# EAGLE design CommCenter_0.1 (EAGLE 7.3.0)
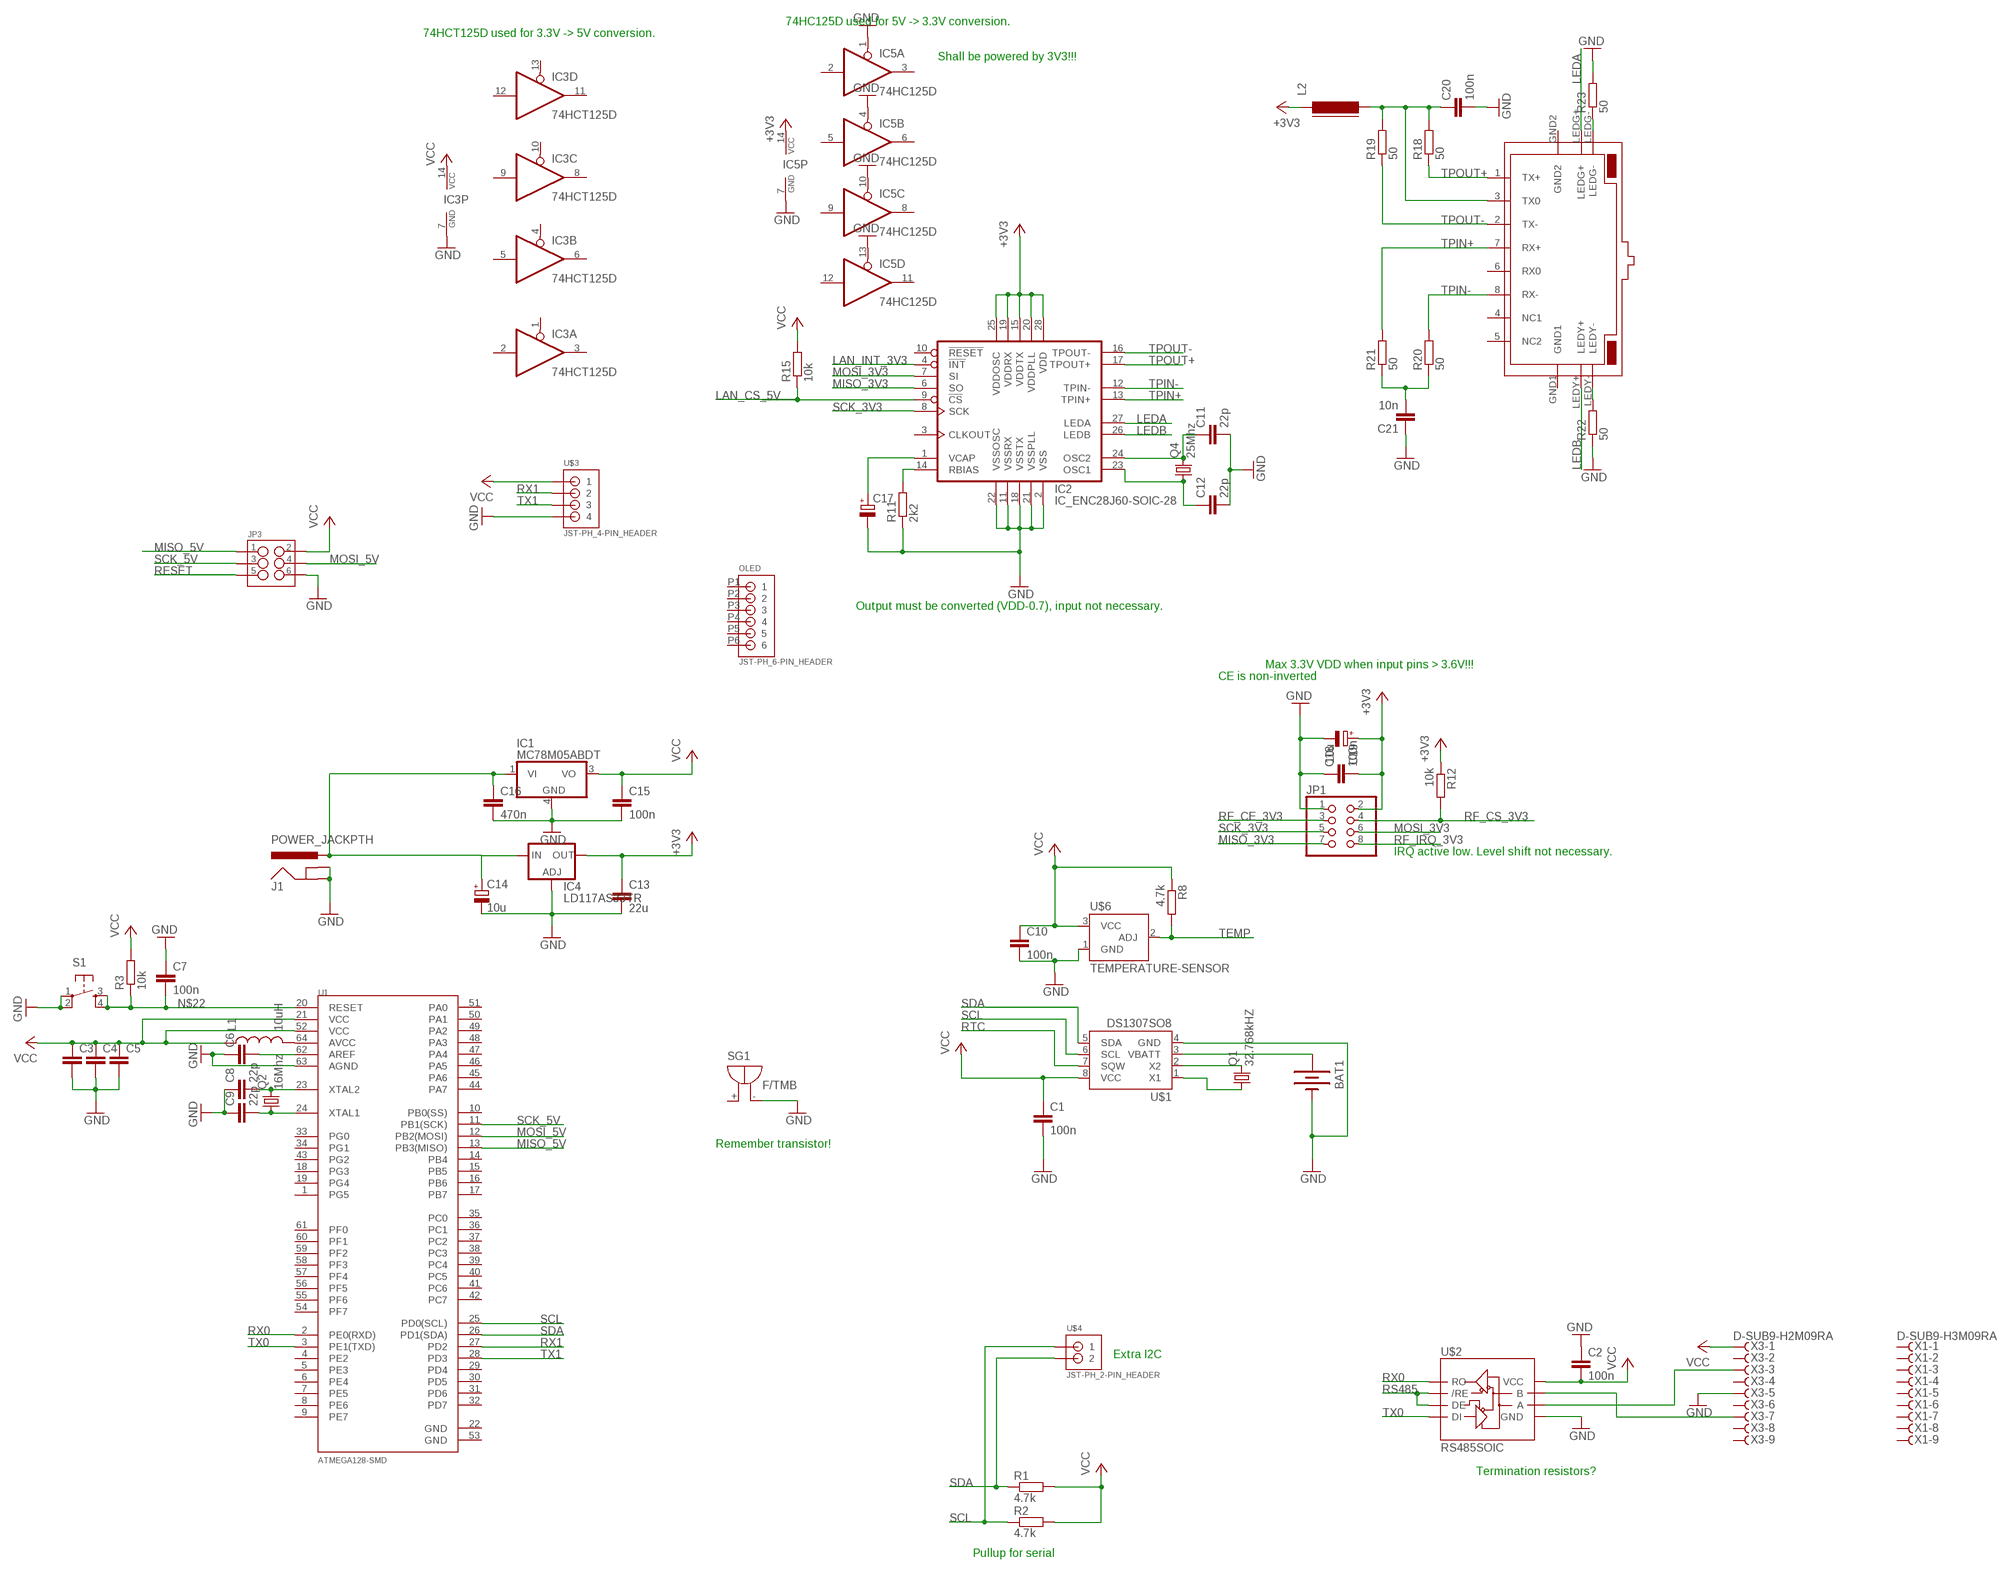
[diagram p0: schematic, sheet 1]

## Parts
BAT1  BATTERY12PTH  [BATTCON_12MM_PTH]
C1  100n  C-EUC0805  [C0805]
C2  100n  C-EUC0805  [C0805]
C3  C-EUC0805  [C0805]
C4  C-EUC0805  [C0805]
C5  C-EUC0805  [C0805]
C6  C-EUC0805  [C0805]
C7  100n  C-EUC0805  [C0805]
C8  22p  C-EUC0805  [C0805]
C9  22p  C-EUC0805  [C0805]
C10  100n  C-EUC0805  [C0805]
C11  22p  C-EUC0805  [C0805]
C12  22p  C-EUC0805  [C0805]
C13  22u  C-EUC1206  [C1206]
C14  10u  CPOL-EU153CLV-0405  [153CLV-0405]
C15  100n  C-EUC0805  [C0805]
C16  470n  C-EUC0805  [C0805]
C17  CPOL-EU153CLV-0405  [153CLV-0405]
C18  100n  C-EUC0805  [C0805]
C19  10u  CPOL-EU153CLV-0405  [153CLV-0405]
C20  100n  C-EUC0805  [C0805]
C21  10n  C-EUC0805  [C0805]
IC1  MC78M05ABDT  [DPACK_3]
IC2  IC_ENC28J60-SOIC-28  [SOIC-28W]
IC3  74HCT125D  [SO14]
IC4  LD117AS33TR  [SOT223]
IC5  74HC125D  [SO14]
J1  POWER_JACKPTH  [POWER_JACK_PTH]
JP1  PINHD-2X4  [2X04]
JP3  M03X2SHROUD  [2X3-SHROUDED]
L1  10uH  INDUCTOR0805  [0805]
L2  FERRITE-PTH-10  [L10]
OLED  JST-PH_6-PIN_HEADER  [JST_B6B-PH_HEADER]
Q1  32.768kHZ  CRYSTALTC26H  [TC26H]
Q2  16Mhz  CRYSTALHC49S  [HC49/S]
Q4  25Mhz  CRYSTALHC49S  [HC49/S]
R1  4.7k  R-EU_R0805  [R0805]
R2  4.7k  R-EU_R0805  [R0805]
R3  10k  R-EU_R0805  [R0805]
R8  4.7k  R-EU_R0805  [R0805]
R11  2k2  R-EU_R0805  [R0805]
R12  10k  R-EU_R0805  [R0805]
R15  10k  R-EU_R0805  [R0805]
R18  50  R-EU_R0805  [R0805]
R19  50  R-EU_R0805  [R0805]
R20  50  R-EU_R0805  [R0805]
R21  50  R-EU_R0805  [R0805]
R22  50  R-EU_R0805  [R0805]
R23  50  R-EU_R0805  [R0805]
S1  TAC_SWITCHSMD  [TACTILE-SWITCH-SMD]
SG1  F/TMB  [F/TMB]
U1  ATMEGA128-SMD  [TQFP64_14X14MM]
U$1  DS1307SO8  [SO08]
U$2  RS485SOIC  [SO08]
U$3  JST-PH_4-PIN_HEADER  [JST_B4B-PH_HEADER]
U$4  JST-PH_2-PIN_HEADER  [JST_B2B-PH_HEADER]
U$5  RJ45-TRAFO-L  [RJ45-TRAFO-L]
U$6  TEMPERATURE-SENSOR  [TO-92]
X1  D-SUB9-H3M09RA  [H3M09RA]
X3  D-SUB9-H2M09RA  [H2M09RA]

## Nets
+3V3: C13.1 C18.2 C19.+ IC2.15(VDDTX) IC2.19(VDDRX) IC2.20(VDDPLL) IC2.25(VDDOSC) IC2.28(VDD) IC4.4(OUT) IC5.14(P:VCC) JP1.2 L2.1 R12.1
GND: BAT1.GND(-) C1.2 C2.1 C3.2 C4.2 C5.2 C6.1 C7.1 C8.1 C9.1 C10.2 C11.2 C12.2 C13.2 C14.- C15.2 C16.2 C17.- C18.1 C19.- C20.2 C21.1 IC1.4(GND) IC2.2(VSS) IC2.11(VSSRX) IC2.18(VSSTX) IC2.21(VSSPLL) IC2.22(VSSOSC) IC3.7(P:GND) IC4.1(ADJ) IC5.1(A:OE) IC5.4(B:OE) IC5.7(P:GND) IC5.10(C:OE) IC5.13(D:OE) J1.GND J1.GNDBREAK JP1.1 JP3.6 R11.1 R22.1 R23.2 S1.1 S1.2 SG1.- U1.63(AGND) U$1.4(GND) U$2.5(GND) U$3.P4 U$6.1(GND) X3.5
LAN_CS_5V: R15.1
LAN_INT_3V3: IC2.4(!INT)
LEDA: IC2.27(LEDA) U$5.LEDG+
LEDB: IC2.26(LEDB) U$5.LEDY+
MISO_3V3: IC2.6(SO) JP1.7
MISO_5V: JP3.1 U1.13(PB3(MISO))
MOSI_3V3: IC2.7(SI) JP1.6
MOSI_5V: JP3.4 U1.12(PB2(MOSI))
N$1: C8.2 Q2.2 U1.23(XTAL2)
N$2: L1.2 U1.64(AVCC)
N$3: Q1.1 U$1.1(X1)
N$4: Q1.2 U$1.2(X2)
N$5: BAT1.VCC@1(+) U$1.3(VBATT)
N$6: U$2.6(A) X3.3
N$7: C9.2 Q2.1 U1.24(XTAL1)
N$8: C11.1 IC2.24(OSC2) Q4.2
N$9: C6.2 U1.62(AREF)
N$10: C14.+ C16.1 IC1.1(VI) IC4.3(IN) J1.PWR
N$11: U$2.7(B) X3.7
N$12: IC2.9(!CS)
N$13: C12.1 IC2.23(OSC1) Q4.1
N$15: IC2.14(RBIAS) R11.2
N$16: C17.+ IC2.1(VCAP)
N$21: C20.1 L2.2 R18.2 R19.2 U$5.3(TX0)
N$22: C7.2 R3.1 S1.3 S1.4 U1.20(RESET)
N$25: C21.2 R20.1 R21.1
N$26: R22.2 U$5.LEDY-
N$27: R23.1 U$5.LEDG-
RESET: JP3.5
RF_CE_3V3: JP1.3
RF_CS_3V3: JP1.4 R12.2
RF_IRQ_3V3: JP1.8
RS485: U$2.2(/RE) U$2.3(DE)
RTC: U$1.7(SQW)
RX0: U1.2(PE0(RXD)) U$2.1(RO)
RX1: U1.27(PD2) U$3.P2
SCK_3V3: IC2.8(SCK) JP1.5
SCK_5V: JP3.3 U1.11(PB1(SCK))
SCL: R2.1 U1.25(PD0(SCL)) U$1.6(SCL) U$4.P1
SDA: R1.1 U1.26(PD1(SDA)) U$1.5(SDA) U$4.P2
TEMP: R8.2 U$6.2(ADJ)
TPIN+: IC2.13(TPIN+) R21.2 U$5.7(RX+)
TPIN-: IC2.12(TPIN-) R20.2 U$5.8(RX-)
TPOUT+: IC2.17(TPOUT+) R18.1 U$5.1(TX+)
TPOUT-: IC2.16(TPOUT-) R19.1 U$5.2(TX-)
TX0: U1.3(PE1(TXD)) U$2.4(DI)
TX1: U1.28(PD3) U$3.P3
VCC: C1.1 C2.2 C3.1 C4.1 C5.1 C10.1 C15.1 IC1.3(VO) IC3.14(P:VCC) JP3.2 L1.1 R1.2 R2.2 R3.2 R8.1 R15.2 U1.21(VCC) U1.52(VCC) U$1.8(VCC) U$2.8(VCC) U$3.P1 U$6.3(VCC) X3.1
Unconnected: IC2.3(CLKOUT) IC2.10(!RESET) IC3.1(A:OE) IC3.2(A:I) IC3.3(A:O) IC3.4(B:OE) IC3.5(B:I) IC3.6(B:O) IC3.8(C:O) IC3.9(C:I) IC3.10(C:OE) IC3.11(D:O) IC3.12(D:I) IC3.13(D:OE) IC5.2(A:I) IC5.3(A:O) IC5.5(B:I) IC5.6(B:O) IC5.8(C:O) IC5.9(C:I) IC5.11(D:O) IC5.12(D:I) OLED.P1 OLED.P2 OLED.P3 OLED.P4 OLED.P5 OLED.P6 SG1.+ U1.1(PG5) U1.4(PE2) U1.5(PE3) U1.6(PE4) U1.7(PE5) U1.8(PE6) U1.9(PE7) U1.10(PB0(SS)) U1.14(PB4) U1.15(PB5) U1.16(PB6) U1.17(PB7) U1.18(PG3) U1.19(PG4) U1.22(GND) U1.29(PD4) U1.30(PD5) U1.31(PD6) U1.32(PD7) U1.33(PG0) U1.34(PG1) U1.35(PC0) U1.36(PC1) U1.37(PC2) U1.38(PC3) U1.39(PC4) U1.40(PC5) U1.41(PC6) U1.42(PC7) U1.43(PG2) U1.44(PA7) U1.45(PA6) U1.46(PA5) U1.47(PA4) U1.48(PA3) U1.49(PA2) U1.50(PA1) U1.51(PA0) U1.53(GND) U1.54(PF7) U1.55(PF6) U1.56(PF5) U1.57(PF4) U1.58(PF3) U1.59(PF2) U1.60(PF1) U1.61(PF0) U$5.4(NC1) U$5.5(NC2) U$5.6(RX0) X1.1 X1.2 X1.3 X1.4 X1.5 X1.6 X1.7 X1.8 X1.9 X3.2 X3.4 X3.6 X3.8 X3.9

## Notes on the sheet
- 74HC125D used for 5V -> 3.3V conversion.
- 74HCT125D used for 3.3V -> 5V conversion.
- Shall be powered by 3V3!!!
- Output must be converted (VDD-0.7), input not necessary.
- Max 3.3V VDD when input pins > 3.6V!!!
- CE is non-inverted
- IRQ active low. Level shift not necessary.
- Remember transistor!
- Extra I2C
- Termination resistors?
- Pullup for serial

## Power pins joined to a net without a drawn wire
GND1: U$5.GND1
GND2: U$5.GND2

## Library data of the parts
BAT1 = SparkFun-Electromechanical:BATTERY: Battery Holders Various common sizes : AA, AAA, 20mm coin cell and 12mm coin cell. 20MM_4LEGS, BATT-10373
C1 C2 C7-C13 C15 C16 C18 C20 C21 = resistor:C-EU: CAPACITOR, European symbol
C3-C6 = rcl:C-EU: CAPACITOR, European symbol
C14 C17 C19 = resistor:CPOL-EU: POLARIZED CAPACITOR, European symbol
IC1 = linear:MC78M: 500 mA Positive Voltage Regulators Source: Data sheet <http://www.onsemi.com/pub_link/Collateral/MC78M00-D.PDF>
IC2 = dp_devices:IC_ENC28J60: Ethernet Controller with SPI Interface
IC3 IC5 = 74xx-eu:74*125: Quad bus BUFFER, 3-state
IC4 = v-reg:LD117A?*: Low drop fixed and adjustable positive voltage regulators 1 A Source: http://www.st.com/stonline/products/literature/ds/7194/ld1117axx.pdf
J1 = SparkFun-Connectors:POWER_JACK: Power Jack This is the standard 5.5mm barrel jack for power. The PTH is the most common, proven, reliable, footprint. The Slot footprint only works if the mill layer is transmitted to the PCB fab house so be warned. Mating wall wart : TOL-00298 (and others); PROD_ID: PRT-00119
JP1 = pinhead:PINHD-2X4: PIN HEADER
JP3 = SparkFun-Connectors:M03X2: 2x3 .1" header. Shrouded, with keying- CONN-10681 SMT- CONN-11415 Pogo pins- HW-11044; PROD_ID: CONN-10681
L1 = SparkFun-Passives:INDUCTOR: Inductors Basic Inductor/Choke - 0603 and 1206. Footprints are not proven and vary greatly between part numbers. SRN6045- 33uH, 20% 1.4A SDR0403-560KL - 56uH, 10%, 500mA RMS/740mA peak
L2 = dp_devices:FERRITE: Ferrite bead in various packages
OLED = SRG:JST-PH_6-PIN_HEADER
Q1 = adafruit:CRYSTAL: CRYSTAL; OC_FARNELL: unknown; OC_NEWARK: unknown
Q2 Q4 = crystal:CRYSTAL: CRYSTAL; OC_FARNELL: 1667008; OC_NEWARK: unknown
R1-R3 R8 R11 R12 R15 R18-R23 = resistor:R-EU_: RESISTOR, European symbol
S1 = SparkFun-Electromechanical:TAC_SWITCH: Momentary Switch Button commonly used for reset or general input. Spark Fun Electronics SKU : COM-00097 SMT- SWCH-08247
SG1 = buzzer:F/TMB: BUZZER Source: Buerklin; OC_FARNELL: unknown; OC_NEWARK: unknown
U1 = SparkFun-DigitalIC:ATMEGA128: ATmega128/128L/1281/2561. Note: The ATmega128 pin 1 is PEN and the ATmega256/1281 pin 1 is PG5.
U$1 = SparkFun-FreqCtrl:DS1307: I2C real-time clock with battery backup.
U$2 = SparkFun-DigitalIC:RS485: RS485 transceiver
U$3 = SRG:JST-PH_4-PIN_HEADER: 4-pin JST PH Shrouded Header, top entry P/N B4B-PH-K-S Mating connector PHR-4 Mating cable assembly: Sparkfun PRT-09916 <http://www.sparkfun.com/products/9916>
U$4 = SRG:JST-PH_2-PIN_HEADER: 2-pin JST PH Shrouded Header, top entry P/N B2B-PH-K-S Mating connector PHR-2 Mating cable assembly: Sparkfun PRT-09914 <http://www.sparkfun.com/products/9914>
U$5 = dea:RJ45-TRAFO-L: RJ45 socket with integrated magnetics and LEDs Naming: Amphenol LMJ1998824110DL1T39J TME RJ45-TRAFO-L Author: Petr Kalandra <mailto:kalandrap@gmail.com> Datasheet: http://zefiryn.tme.pl/dok/zlacza/rjtrafol.PDF
U$6 = SparkFun-Sensors:TEMPERATURE-SENSOR: TO-92 temp sensor
X1 X3 = con-thomas-betts:D-SUB9-: D-Subminiatur Connector Source: Electronioc Interconnects European Edition 1998; OC_FARNELL: unknown; OC_NEWARK: unknown

## Board
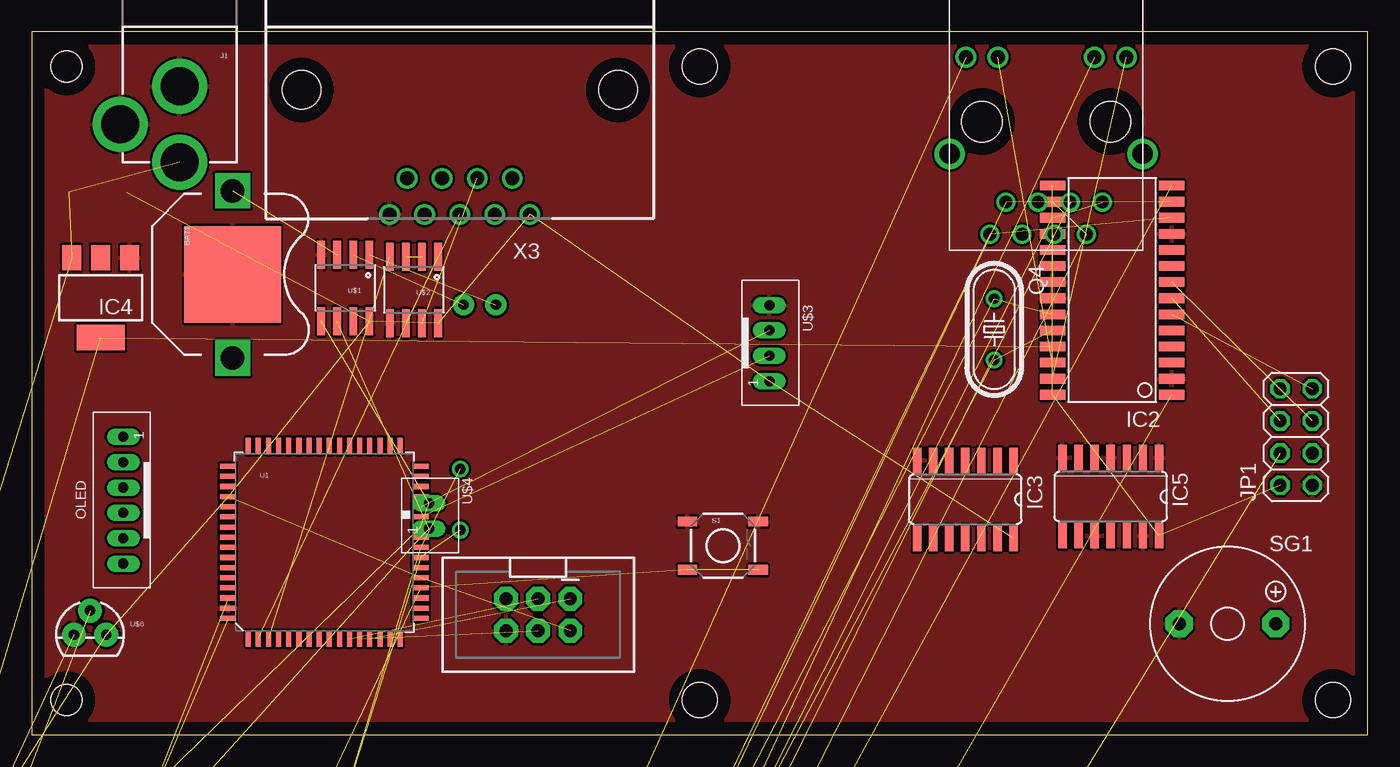
[diagram p1: board, top side]
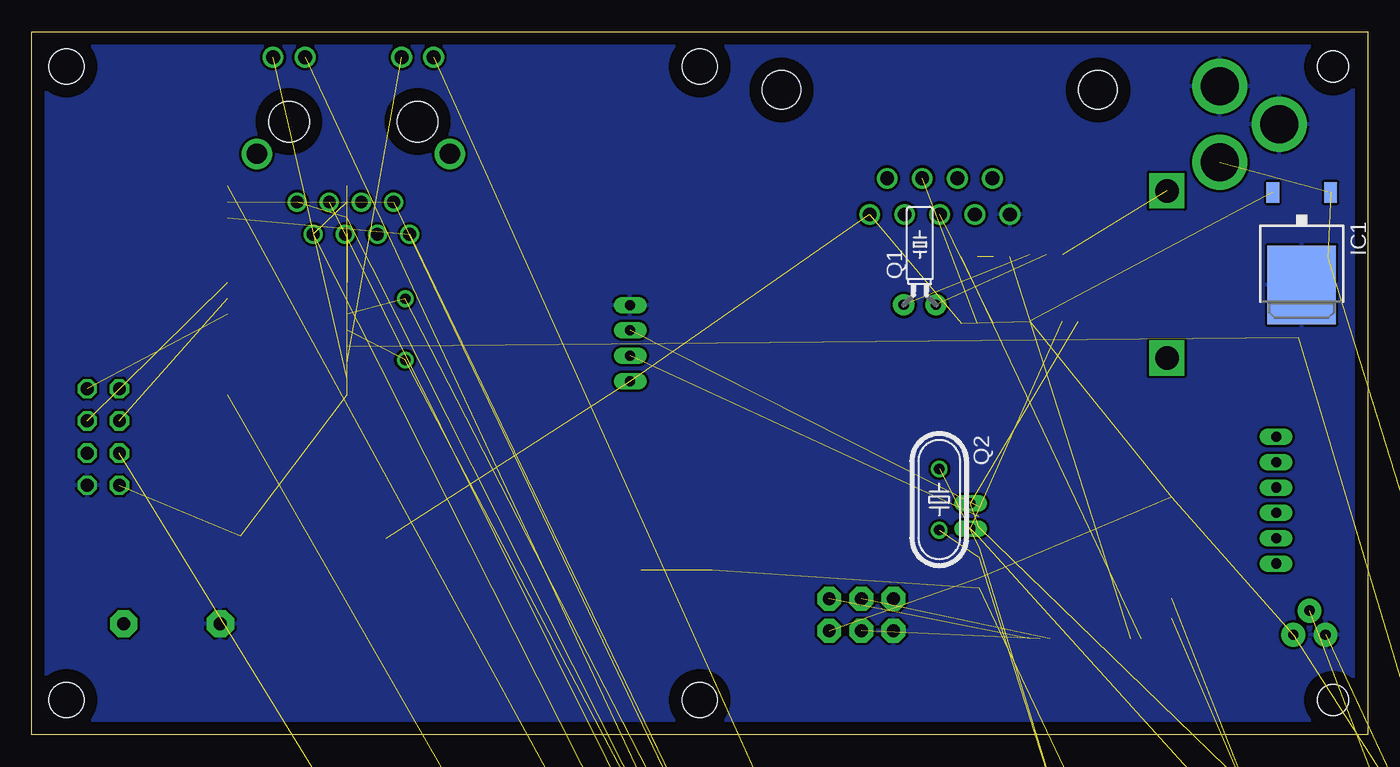
[diagram p2: board, bottom side, seen from below]

Size 105.5 x 55.5 mm. Coordinates in mm from the lower left corner, seen from the top.
Outline: 0,0 105.5,0 105.5,55.5 0,55.5 0,0
Copper layers (1*16): Top 0.035mm / dielectric 1.5mm / Bottom 0.035mm
Design rules "default": minimum track width 10mil, minimum drill 24mil, track to track 8mil, track to pad 8mil, pad to pad 8mil, via to via 8mil, smd to smd 8mil, copper to edge 40mil, drill to drill 8mil, minimum pad ring 10mil, minimum via ring 8mil, stop-mask expansion 4mil, vias tented up to drill 0mil, thermal gap 10mil
Holes 2.5 mm at 2.75,2.75 2.75,52.75
Holes 2.8 mm at 52.75,2.75 52.75,52.75 102.75,2.75 102.75,52.75

### Footprints (pad centres in the part's own frame; a part is rotated, then mirrored left to right if it is on the bottom)
BATTCON_12MM_PTH = smd 7.62 x 7.62: GND 0,0 | drill 1.854 square: VCC@1 -6.604,0; VCC@2 6.604,0
C0805 = smd 1.3 x 1.5: 1 -0.85,0; 2 0.85,0
C0805' = smd 1.3 x 1.5: 1 -0.95,0; 2 0.95,0
C1206 = smd 1.6 x 1.8: 1 -1.4,0; 2 1.4,0
153CLV-0405 = smd 2.6 x 1.6: + 1.8,0; - -1.8,0
DPACK_3 = smd 1 x 1.6: 1 -2.28,-4.8; 3 2.28,-4.8 | smd 5.4 x 6.2: 4 0,2.5
SOIC-28W = smd 0.762 x 2: 1 -8.89,-4.7; 2 -7.62,-4.7; 3 -6.35,-4.7; 4 -5.08,-4.7; 5 -3.81,-4.7; 6 -2.54,-4.7; 7 -1.27,-4.7; 8 0,-4.7; 9 1.27,-4.7; 10 2.54,-4.7; 11 3.81,-4.7; 12 5.08,-4.7; 13 6.35,-4.7; 14 7.62,-4.7; 15 7.62,4.7; 16 6.35,4.7; 17 5.08,4.7; 18 3.81,4.7; 19 2.54,4.7; 20 1.27,4.7; 21 0,4.7; 22 -1.27,4.7; 23 -2.54,4.7; 24 -3.81,4.7; 25 -5.08,4.7; 26 -6.35,4.7; 27 -7.62,4.7; 28 -8.89,4.7
SO14 = smd 0.66 x 2.032: 1 -3.81,-3.073; 2 -2.54,-3.073; 3 -1.27,-3.073; 4 0,-3.073; 5 1.27,-3.073; 6 2.54,-3.073; 7 3.81,-3.073; 8 3.81,3.073; 9 2.54,3.073; 10 1.27,3.073; 11 0,3.073; 12 -1.27,3.073; 13 -2.54,3.073; 14 -3.81,3.073
SOT223 = smd 1.5 x 2: 1 -2.3,-3.15; 2 0,-3.15; 3 2.3,-3.15 | smd 3.8 x 2: 4 0,3.15
POWER_JACK_PTH = drill 2.997 pad 4.318: GND 0,7.7; GNDBREAK 4.7,10.7; PWR 0,13.7
2X04 = drill 1.016 octagon: 1 -3.81,-1.27; 2 -3.81,1.27; 3 -1.27,-1.27; 4 -1.27,1.27; 5 1.27,-1.27; 6 1.27,1.27; 7 3.81,-1.27; 8 3.81,1.27
2X3-SHROUDED = drill 1.016 pad 1.88 octagon: 1 -1.27,2.54; 2 1.27,2.54; 3 -1.27,0; 4 1.27,0; 5 -1.27,-2.54; 6 1.27,-2.54
0805 = smd 0.8 x 1.2: 1 -0.9,0; 2 0.9,0
L10 = drill 1.118: 1 -5.08,0; 2 5.08,0
JST_B6B-PH_HEADER = drill 0.8 long: P1 5,0; P2 3,0; P3 1,0; P4 -1,0; P5 -3,0; P6 -5,0
TC26H = drill 0.813 pad 1.676: 1 -1.27,0; 2 1.27,0
HC49/S = drill 0.813: 1 -2.413,0; 2 2.413,0
R0805 = smd 1.3 x 1.5: 1 -0.85,0; 2 0.85,0
TACTILE-SWITCH-SMD = smd 1.524 x 0.762: 1 -2.794,1.905; 2 2.794,1.905; 3 -2.794,-1.905; 4 2.794,-1.905
F/TMB = drill 1.016 pad 2.159 octagon: + 3.81,0; - -3.81,0
TQFP64_14X14MM = smd 0.4 x 1.27: 1 -6,-7.6; 2 -5.2,-7.6; 3 -4.4,-7.6; 4 -3.6,-7.6; 5 -2.8,-7.6; 6 -2,-7.6; 7 -1.2,-7.6; 8 -0.4,-7.6; 9 0.4,-7.6; 10 1.2,-7.6; 11 2,-7.6; 12 2.8,-7.6; 13 3.6,-7.6; 14 4.4,-7.6; 15 5.2,-7.6; 16 6,-7.6; 33 6,7.6; 34 5.2,7.6; 35 4.4,7.6; 36 3.6,7.6; 37 2.8,7.6; 38 2,7.6; 39 1.2,7.6; 40 0.4,7.6; 41 -0.4,7.6; 42 -1.2,7.6; 43 -2,7.6; 44 -2.8,7.6; 45 -3.6,7.6; 46 -4.4,7.6; 47 -5.2,7.6; 48 -6,7.6 | smd 1.27 x 0.4: 17 7.6,-6; 18 7.6,-5.2; 19 7.6,-4.4; 20 7.6,-3.6; 21 7.6,-2.8; 22 7.6,-2; 23 7.6,-1.2; 24 7.6,-0.4; 25 7.6,0.4; 26 7.6,1.2; 27 7.6,2; 28 7.6,2.8; 29 7.6,3.6; 30 7.6,4.4; 31 7.6,5.2; 32 7.6,6; 49 -7.6,6; 50 -7.6,5.2; 51 -7.6,4.4; 52 -7.6,3.6; 53 -7.6,2.8; 54 -7.6,2; 55 -7.6,1.2; 56 -7.6,0.4; 57 -7.6,-0.4; 58 -7.6,-1.2; 59 -7.6,-2; 60 -7.6,-2.8; 61 -7.6,-3.6; 62 -7.6,-4.4; 63 -7.6,-5.2; 64 -7.6,-6
SO08 = smd 0.61 x 2.21: 1 -1.905,-2.616; 2 -0.635,-2.616; 3 0.635,-2.616; 4 1.905,-2.616; 5 1.905,2.616; 6 0.635,2.616; 7 -0.635,2.616; 8 -1.905,2.616
JST_B4B-PH_HEADER = drill 0.8 long: P1 2.98,0.048; P2 0.98,0.048; P3 -1.02,0.048; P4 -3.02,0.048
JST_B2B-PH_HEADER = drill 0.8 long: P1 1.075,0.048; P2 -0.925,0.048
RJ45-TRAFO-L = drill 1: 1 -4.445,6.35; 2 -3.175,8.89; 3 -1.905,6.35; 4 -0.635,8.89; 5 0.635,6.35; 6 1.905,8.89; 7 3.175,6.35; 8 4.445,8.89 | drill 1.6: GND1 -7.62,2.54; GND2 7.62,2.54 | drill 1.1: LEDG+ -6.35,-5.08; LEDG- -3.81,-5.08; LEDY+ 3.81,-5.08; LEDY- 6.35,-5.08 | hole 3.2: -5.08,0; 5.08,0
TO-92 = drill 0.813 pad 1.88: 1 -1.27,0; 2 0,1.905; 3 1.27,0
H3M09RA = drill 1.092: 1 -5.537,1.422; 2 -2.769,1.422; 3 0,1.422; 4 2.769,1.422; 5 5.537,1.422; 6 -4.153,-1.422; 7 -1.384,-1.422; 8 1.384,-1.422; 9 4.153,-1.422 | hole 3.048: -12.497,0; 12.497,0
H2M09RA = drill 1.092: 1 -5.537,7.925; 2 -2.769,7.925; 3 0,7.925; 4 2.769,7.925; 5 5.537,7.925; 6 -4.153,5.08; 7 -1.384,5.08; 8 1.384,5.08; 9 4.153,5.08 | hole 3.048: -12.497,-1.905; 12.497,-1.905

### Placement (x,y rotation side)
BAT1  15.87,36.34 270 top
C1  -8.89,-16.51 0 top  (outside the outline)
C2  -24.13,-48.26 0 top  (outside the outline)
C3  [C0805']  -113.03,-298.45 0 top  (outside the outline)
C4  [C0805']  -113.03,-303.53 0 top  (outside the outline)
C5  [C0805']  -113.03,-308.61 0 top  (outside the outline)
C6  [C0805']  -113.03,-313.69 0 top  (outside the outline)
C7  -35.56,-127 0 top  (outside the outline)
C8  -35.56,-193.04 0 top  (outside the outline)
C9  -35.56,-199.39 0 top  (outside the outline)
C10  -138,-355 0 top  (outside the outline)
C11  -138,-377 0 top  (outside the outline)
C12  -138,-383 0 top  (outside the outline)
C13  -69.85,-224.79 0 top  (outside the outline)
C14  -78.74,-220.98 0 top  (outside the outline)
C15  -78.74,-228.6 0 top  (outside the outline)
C16  -78.74,-234.95 0 top  (outside the outline)
C17  -146,-381 0 top  (outside the outline)
C18  -78.74,-254 0 top  (outside the outline)
C19  -87.63,-264.16 0 top  (outside the outline)
C20  -172,-455 0 top  (outside the outline)
C21  -172,-485 0 top  (outside the outline)
IC1  5.22,38.01 180 bottom
IC2  85.31,35.73 90 top
IC3  73.72,18.59 180 top
IC4  5.45,34.5 180 top
IC5  85.2,18.8 180 top
J1  11.69,58.89 180 top
JP1  99.84,23.51 90 top
JP3  39.99,9.48 270 top
L1  -114.3,-292.1 0 top  (outside the outline)
L2  -168,-450 0 top  (outside the outline)
OLED  7.24,18.52 90 top
Q1  35.37,33.94 0 bottom
Q2  33.84,18.57 270 bottom
Q4  76,32 270 top
R1  -8.89,-22.86 0 top  (outside the outline)
R2  -8.89,-29.21 0 top  (outside the outline)
R3  -35.56,-147.32 0 top  (outside the outline)
R8  -138,-361 0 top  (outside the outline)
R11  -147,-389 0 top  (outside the outline)
R12  -87.63,-279.4 0 top  (outside the outline)
R15  -138.43,-349.25 0 top  (outside the outline)
R18  -172,-461 0 top  (outside the outline)
R19  -172,-467 0 top  (outside the outline)
R20  -172,-473 0 top  (outside the outline)
R21  -172,-479 0 top  (outside the outline)
R22  -172,-491 0 top  (outside the outline)
R23  -172,-497 0 top  (outside the outline)
S1  54.58,14.93 0 top
SG1  94.42,8.77 0 top
U1  23.1,15.2 0 top
U$1  24.76,35.28 180 top
U$2  30.18,35.12 180 top
U$3  58.2,30.9 270 top
U$4  31.32,17.36 270 top
U$5  80.1,48.4 180 top
U$6  4.61,7.9 0 top
X1  29.5,72.9 180 top  (outside the outline)
X3  33.8,49 180 top

### Tracks (layer width: path | path; a pad name or v marks a point on that pad's centre or on a via)
+3V3  (12 unrouted)
GND  (25 unrouted)
  pour Bottom: 0,0 0,55.5 105.5,55.5 105.5,0
  pour Top: 0,0 0,55.5 105.5,55.5 105.5,0
LEDA  (1 unrouted)
LEDB  (1 unrouted)
MISO_3V3  (1 unrouted)
MISO_5V  (1 unrouted)
MOSI_3V3  (1 unrouted)
MOSI_5V  (1 unrouted)
N$1  (2 unrouted)
N$2  (1 unrouted)
N$3  (1 unrouted)
N$4  (1 unrouted)
N$5  (1 unrouted)
N$6  (1 unrouted)
N$7  (2 unrouted)
N$8  (2 unrouted)
N$9  (1 unrouted)
N$10  (4 unrouted)
N$11  (1 unrouted)
N$13  (2 unrouted)
N$14
  pour Bottom: 0,0 0,55.5 105.5,55.5 105.5,0
N$15  (1 unrouted)
N$16  (1 unrouted)
N$17
  pour Top: 0,0 0,55.5 105.5,55.5 105.5,0
N$21  (4 unrouted)
N$22  (4 unrouted)
N$25  (2 unrouted)
N$26  (1 unrouted)
N$27  (1 unrouted)
RF_CS_3V3  (1 unrouted)
RS485  (1 unrouted)
RX0  (1 unrouted)
RX1  (1 unrouted)
SCK_3V3  (1 unrouted)
SCK_5V  (1 unrouted)
SCL  (3 unrouted)
SDA  (3 unrouted)
TEMP  (1 unrouted)
TPIN+  (2 unrouted)
TPIN-  (2 unrouted)
TPOUT+  (2 unrouted)
TPOUT-  (2 unrouted)
TX0  (1 unrouted)
TX1  (1 unrouted)
VCC  (22 unrouted)